# EAGLE design lm317 (EAGLE 7.1.0)
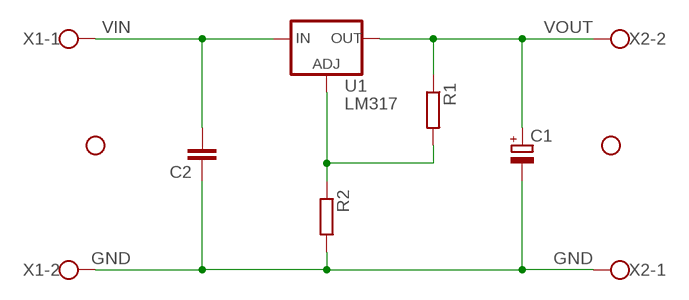
[diagram p0: schematic, sheet 1]

## Parts
C1  CPOL-EUE2.5-6  [E2,5-6]
C2  C-EUC1206K  [C1206K]
R1  R-EU_M1206  [M1206]
R2  R-EU_M1206  [M1206]
STANDOFF1  STAND-OFF  [STAND-OFF]
STANDOFF2  STAND-OFF  [STAND-OFF]
U1  LM317  V_REG_317SINK  [TO220-ADJ]
X1  W237-102  [W237-102]
X2  W237-102  [W237-102]

## Nets
GND: C1.- C2.1 R2.2 X1.2 X2.1
N$3: R1.2 R2.1 U1.ADJ
VIN: C2.2 U1.IN X1.1
VOUT: C1.+ R1.1 U1.OUT X2.2

## Library data of the parts
C1 = rcl:CPOL-EU: POLARIZED CAPACITOR, European symbol
C2 = rcl:C-EU: CAPACITOR, European symbol
R1 R2 = rcl:R-EU_: RESISTOR, European symbol
STANDOFF1 STANDOFF2 = SparkFun-Electromechanical:STAND-OFF: #4 Stand Off This is the mechanical footprint for a #4 phillips button head screw. Use the keepout ring to avoid running the screw head into surrounding components. SKU : PRT-00447
U1 = SparkFun-PowerIC:V_REG_317: Voltage Regulator Standard LM317 adjustable voltage regulator. AOI (Adjust Output Input). Google 'LM317 Calculator' for easy to use app to get the two resistor values needed. 240/720 for 5V output. 240/390 for 3.3V output. Spark Fun Electronics SKU : COM-00527
X1 X2 = con-wago-500:W237-102: WAGO SCREW CLAMP; MPN: 237-102; OC_FARNELL: unknown; OC_NEWARK: 70K9898

## Board
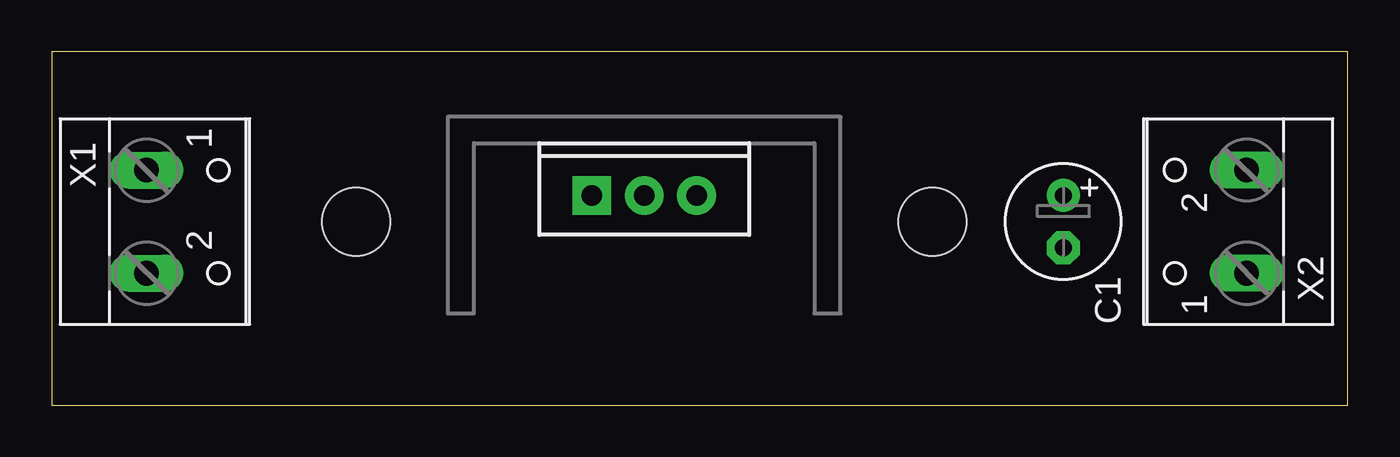
[diagram p1: board, top side]
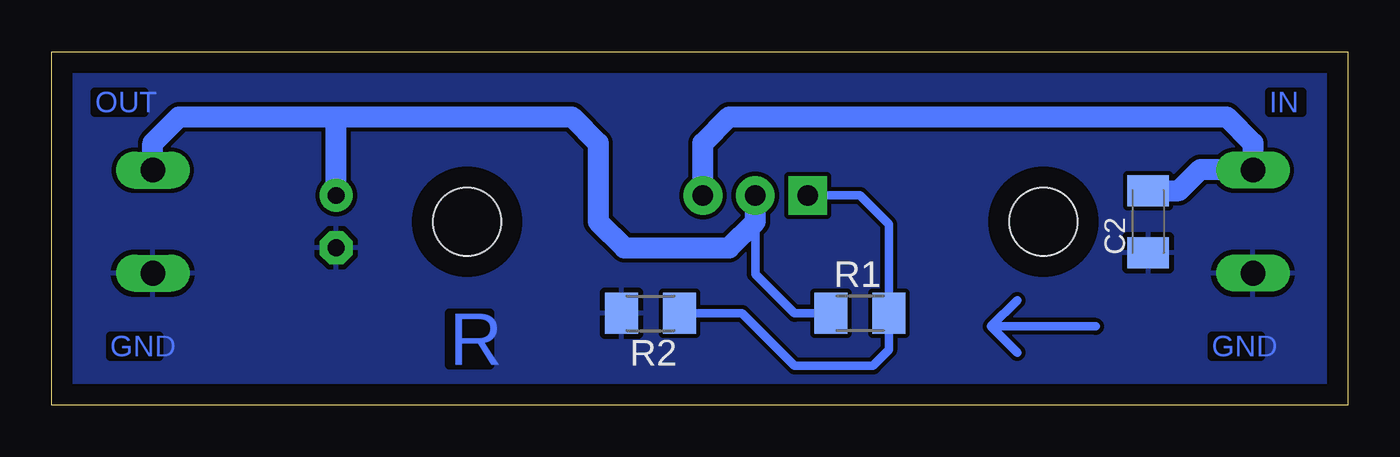
[diagram p2: board, bottom side, seen from below]

Size 62.87 x 17.13 mm. Coordinates in mm from the lower left corner, seen from the top.
Outline: 0,0 62.87,0 62.87,17.13 0,17.13 0,0
Copper layers (1*16): Top 0.035mm / dielectric 1.5mm / Bottom 0.035mm
Design rules "default": minimum track width 10mil, minimum drill 24mil, track to track 8mil, track to pad 8mil, pad to pad 8mil, via to via 8mil, smd to smd 8mil, copper to edge 40mil, drill to drill 8mil, minimum pad ring 10mil, minimum via ring 8mil, stop-mask expansion 4mil, vias tented up to drill 0mil, thermal gap 10mil

### Footprints (pad centres in the part's own frame; a part is rotated, then mirrored left to right if it is on the bottom)
E2,5-6 = drill 0.813 pad 1.6: + -1.27,0 | drill 0.813 pad 1.6 octagon: - 1.27,0
C1206K = smd 1.5 x 2: 1 -1.5,0; 2 1.5,0
M1206 = smd 1.6 x 2: 1 -1.4,0; 2 1.4,0
STAND-OFF = hole 3.302: 0,0
TO220-ADJ = drill 1 pad 1.88 square: ADJ -2.54,0 | drill 1 pad 1.88: IN 2.54,0; OUT 0,0
W237-102 = drill 1.194 long: 1 -2.5,-1.27; 2 2.5,-1.27

### Placement (x,y rotation side)
C1  49.06,8.89 270 top
C2  9.69,8.89 90 bottom
R1  23.66,4.45 0 bottom
R2  33.82,4.45 180 bottom
STANDOFF1  14.77,8.89 0 top
STANDOFF2  42.71,8.89 0 top
U1  28.74,10.16 0 top
X1  5.88,8.89 270 top
X2  56.68,8.89 90 top

### Tracks (layer width: path | path; a pad name or v marks a point on that pad's centre or on a via)
GND
  pour Bottom: -4.28,19.05 66.84,19.05 66.84,-2.54 -4.28,-2.54
N$1
  Bottom 0.406: 12.23,3.81 17.31,3.81 | 17.31,3.81 16.04,5.08 | 17.31,3.81 16.04,2.54
N$3
  Bottom 0.406: U1.ADJ 23.66,10.16 22.26,8.76 R1.2 22.26,2.67 23.03,1.91 26.84,1.91 29.38,4.45 R2.1
VIN
  Bottom 1.016: U1.IN 31.28,12.7 30.01,13.97 5.88,13.97 4.61,12.7 X1.1 4.65,11.43 7.15,11.43 8.19,10.39 C2.2
VOUT
  Bottom 0.406: R1.1 26.84,4.45 28.74,6.35 28.74,8.89
  Bottom 1.016: X2.2 57.95,12.7 56.68,13.97 49.06,13.97 | 49.06,13.97 37.63,13.97 36.36,12.7 36.36,8.89 35.09,7.62 30.01,7.62 28.74,8.89 U1.OUT | C1.+ 49.06,13.97

### Text on the board
Bottom: IN | OUT | GND | GND | R